# EAGLE design rover 5 (EAGLE 7.2.0)
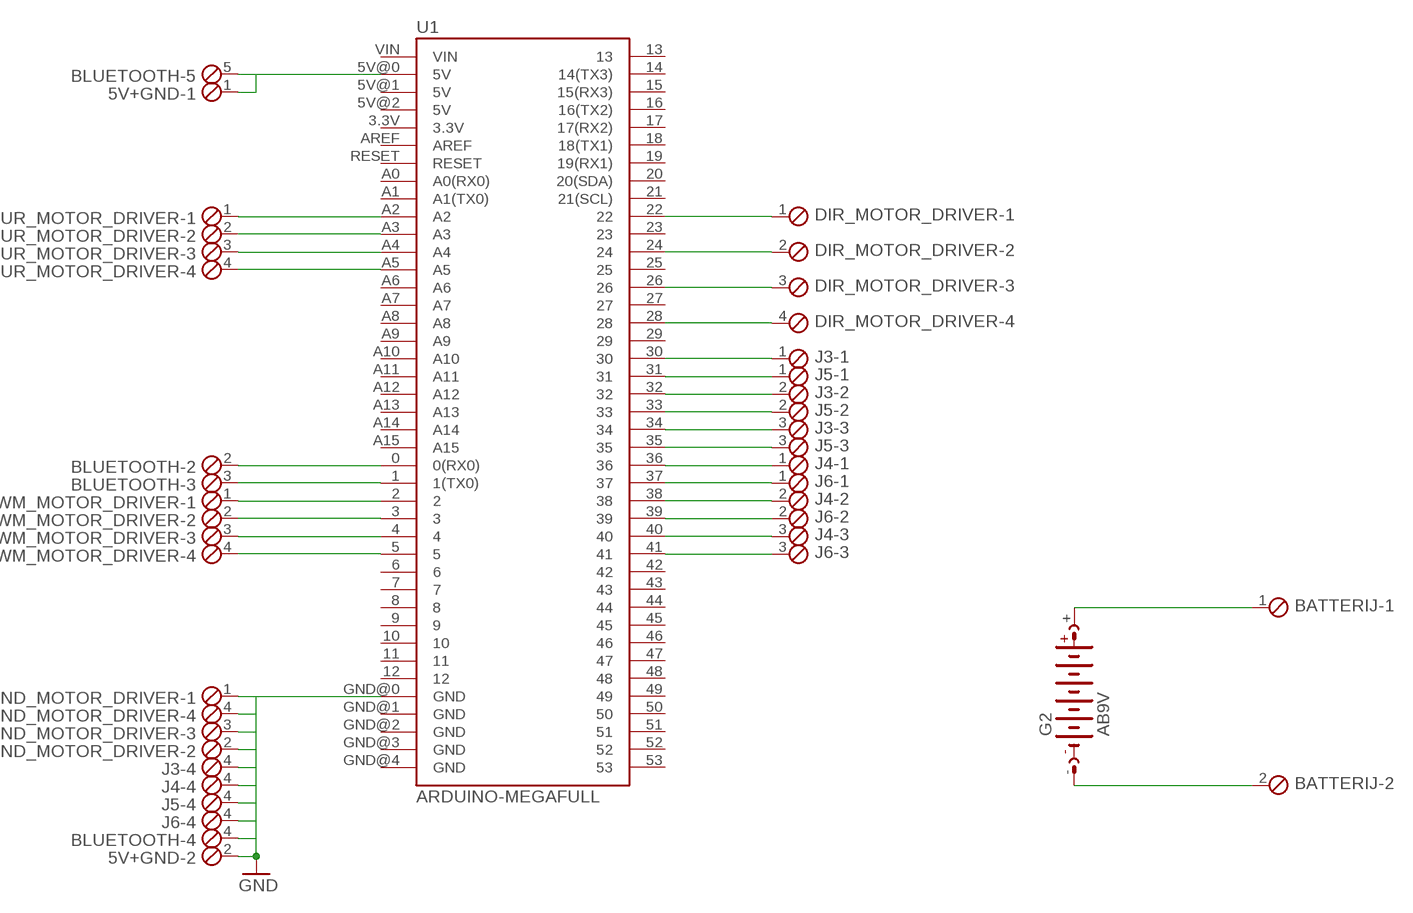
[diagram p0: schematic, sheet 1]

## Parts
5V+GND  MPT2  [2POL254]
BATTERIJ  MPT2  [2POL254]
BLUETOOTH  MPT6  [6POL254]
CUR_MOTOR_DRIVER  MPT4  [4POL254]
DIR_MOTOR_DRIVER  MPT4  [4POL254]
G2  AB9V  [AB9V]
GND_MOTOR_DRIVER  MPT4  [4POL254]
J3  MPT4  [4POL254]
J4  MPT4  [4POL254]
J5  MPT4  [4POL254]
J6  MPT4  [4POL254]
PWM_MOTOR_DRIVER  MPT4  [4POL254]
U1  ARDUINO-MEGAFULL  [ARDUINO_MEGA]

## Nets
GND: 5V+GND.2 BLUETOOTH.4 GND_MOTOR_DRIVER.1 GND_MOTOR_DRIVER.2 GND_MOTOR_DRIVER.3 GND_MOTOR_DRIVER.4 J3.4 J4.4 J5.4 J6.4 U1.GND@0(GND)
N$1: DIR_MOTOR_DRIVER.1 U1.22
N$2: PWM_MOTOR_DRIVER.1 U1.2
N$3: PWM_MOTOR_DRIVER.2 U1.3
N$4: PWM_MOTOR_DRIVER.3 U1.4
N$5: PWM_MOTOR_DRIVER.4 U1.5
N$6: DIR_MOTOR_DRIVER.2 U1.24
N$7: DIR_MOTOR_DRIVER.3 U1.26
N$8: DIR_MOTOR_DRIVER.4 U1.28
N$9: J3.1 U1.30
N$10: CUR_MOTOR_DRIVER.1 U1.A2
N$11: CUR_MOTOR_DRIVER.2 U1.A3
N$12: CUR_MOTOR_DRIVER.3 U1.A4
N$13: CUR_MOTOR_DRIVER.4 U1.A5
N$14: J5.1 U1.31
N$15: J3.2 U1.32
N$16: J5.2 U1.33
N$17: J3.3 U1.34
N$18: J5.3 U1.35
N$19: J4.1 U1.36
N$20: J6.1 U1.37
N$21: J4.2 U1.38
N$22: J6.2 U1.39
N$23: J4.3 U1.40
N$24: J6.3 U1.41
N$26: BLUETOOTH.2 U1.0(0(RX0))
N$27: BLUETOOTH.3 U1.1(1(TX0))
N$28: 5V+GND.1 BLUETOOTH.5 U1.5V@0(5V)
N$29: BATTERIJ.1 G2.+
N$30: BATTERIJ.2 G2.-
Unconnected: BLUETOOTH.1 BLUETOOTH.6 U1.3.3V U1.5V@1(5V) U1.5V@2(5V) U1.6 U1.7 U1.8 U1.9 U1.10 U1.11 U1.12 U1.13 U1.14(14(TX3)) U1.15(15(RX3)) U1.16(16(TX2)) U1.17(17(RX2)) U1.18(18(TX1)) U1.19(19(RX1)) U1.20(20(SDA)) U1.21(21(SCL)) U1.23 U1.25 U1.27 U1.29 U1.42 U1.43 U1.44 U1.45 U1.46 U1.47 U1.48 U1.49 U1.50 U1.51 U1.52 U1.53 U1.A0(A0(RX0)) U1.A1(A1(TX0)) U1.A6 U1.A7 U1.A8 U1.A9 U1.A10 U1.A11 U1.A12 U1.A13 U1.A14 U1.A15 U1.AREF U1.GND@1(GND) U1.GND@2(GND) U1.GND@3(GND) U1.GND@4(GND) U1.RESET U1.VIN

## Library data of the parts
5V+GND BATTERIJ = con-phoenix-254:MPT2: PHOENIX CONNECTOR; OC_FARNELL: unknown; OC_NEWARK: unknown
BLUETOOTH = con-phoenix-254:MPT6: PHOENIX CONNECTOR; OC_FARNELL: unknown; OC_NEWARK: unknown
CUR_MOTOR_DRIVER DIR_MOTOR_DRIVER GND_MOTOR_DRIVER J3-J6 PWM_MOTOR_DRIVER = con-phoenix-254:MPT4: PHOENIX CONNECTOR; OC_FARNELL: unknown; OC_NEWARK: unknown
G2 = rover 5 battery klem:AB9V: 9-V BATTERY CLIP
U1 = SparkFun-Boards:ARDUINO-MEGA: Arduino Mega board footprint

## Board
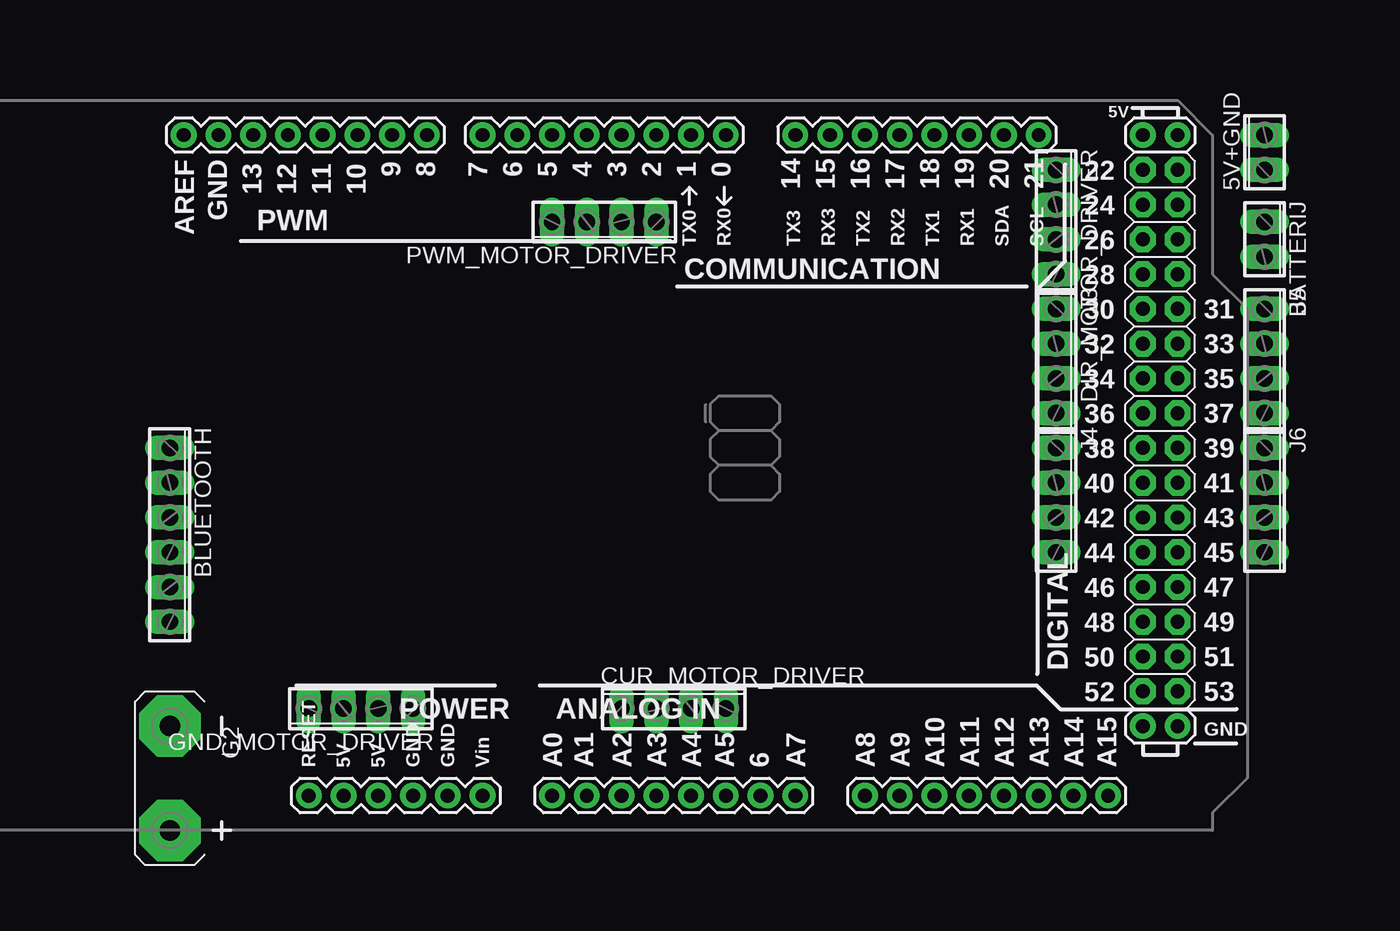
[diagram p1: board, top side]
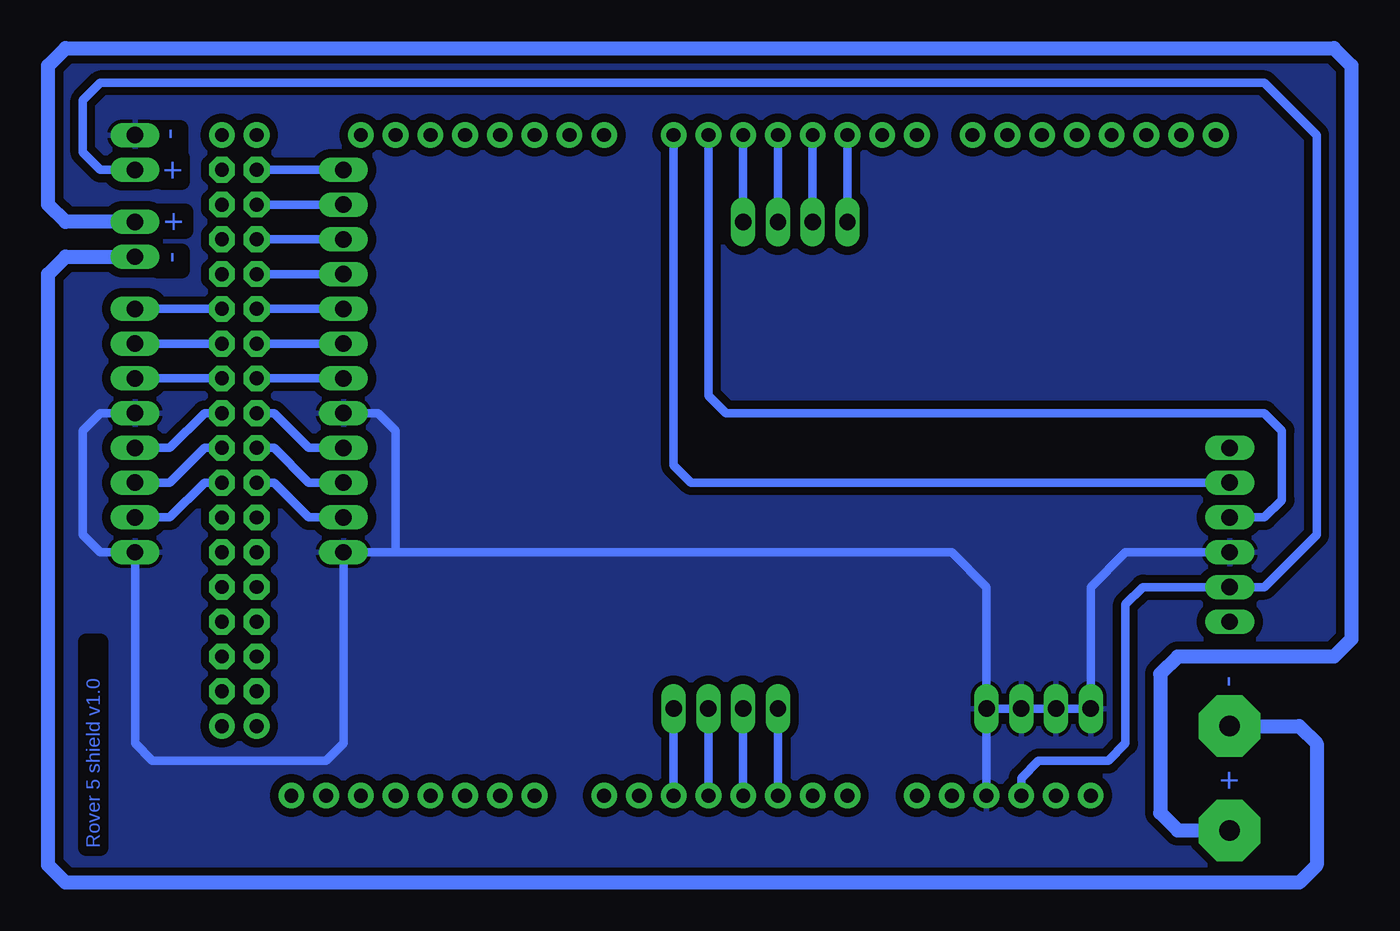
[diagram p2: board, bottom side, seen from below]

No outline drawn. Coordinates in mm, seen from the top.
Copper layers (1*16): Top 0.035mm / dielectric 1.5mm / Bottom 0.035mm
Design rules "default": minimum track width 10mil, minimum drill 24mil, track to track 8mil, track to pad 8mil, pad to pad 8mil, via to via 8mil, smd to smd 8mil, copper to edge 40mil, drill to drill 8mil, minimum pad ring 10mil, minimum via ring 8mil, stop-mask expansion 4mil, vias tented up to drill 0mil, thermal gap 10mil

### Footprints (pad centres in the part's own frame; a part is rotated, then mirrored left to right if it is on the bottom)
2POL254 = drill 1.2 long: 1 -1.27,0; 2 1.27,0
6POL254 = drill 1.2 pad 1.778 long: 1 -6.35,0; 2 -3.81,0; 3 -1.27,0; 4 1.27,0; 5 3.81,0; 6 6.35,0
4POL254 = drill 1.2 long: 1 -3.81,0; 2 -1.27,0; 3 1.27,0; 4 3.81,0
AB9V = drill 1.5 pad 4.5 octagon: + 0,2.54; - 0,-5.08
ARDUINO_MEGA = drill 1.016 pad 1.88: 0 63.5,50.8; 1 60.96,50.8; 2 58.42,50.8; 3 55.88,50.8; 3.3V 35.56,2.54; 4 53.34,50.8; 5 50.8,50.8; 5V@0 38.1,2.54; 5V@1 93.98,50.8; 5V@2 96.52,50.8; 6 48.26,50.8; 7 45.72,50.8; 8 41.656,50.8; 9 39.116,50.8; 10 36.576,50.8; 11 34.036,50.8; 12 31.496,50.8; 13 28.956,50.8; 14 68.58,50.8; 15 71.12,50.8; 16 73.66,50.8; 17 76.2,50.8; 18 78.74,50.8; 19 81.28,50.8; 20 83.82,50.8; 21 86.36,50.8; A0 50.8,2.54; A1 53.34,2.54; A2 55.88,2.54; A3 58.42,2.54; A4 60.96,2.54; A5 63.5,2.54; A6 66.04,2.54; A7 68.58,2.54; A8 73.66,2.54; A9 76.2,2.54; A10 78.74,2.54; A11 81.28,2.54; A12 83.82,2.54; A13 86.36,2.54; A14 88.9,2.54; A15 91.44,2.54; AREF 23.876,50.8; GND@0 40.64,2.54; GND@1 43.18,2.54; GND@2 93.98,7.62; GND@3 96.52,7.62; GND@4 26.416,50.8; RESET 33.02,2.54; VIN 45.72,2.54 | drill 1.016 pad 1.88 octagon: 22 93.98,48.26; 23 96.52,48.26; 24 93.98,45.72; 25 96.52,45.72; 26 93.98,43.18; 27 96.52,43.18; 28 93.98,40.64; 29 96.52,40.64; 30 93.98,38.1; 31 96.52,38.1; 32 93.98,35.56; 33 96.52,35.56; 34 93.98,33.02; 35 96.52,33.02; 36 93.98,30.48; 37 96.52,30.48; 38 93.98,27.94; 39 96.52,27.94; 40 93.98,25.4; 41 96.52,25.4; 42 93.98,22.86; 43 96.52,22.86; 44 93.98,20.32; 45 96.52,20.32; 46 93.98,17.78; 47 96.52,17.78; 48 93.98,15.24; 49 96.52,15.24; 50 93.98,12.7; 51 96.52,12.7; 52 93.98,10.16; 53 96.52,10.16

### Placement (x,y rotation side)
5V+GND  100.33,49.53 90 top
BATTERIJ  100.33,43.18 270 top
BLUETOOTH  20.32,21.59 270 top
CUR_MOTOR_DRIVER  57.15,8.89 0 top
DIR_MOTOR_DRIVER  85.09,44.45 270 top
G2  20.32,2.54 180 top
GND_MOTOR_DRIVER  34.29,8.89 180 top
J3  85.09,34.29 270 top
J4  85.09,24.13 270 top
J5  100.33,34.29 270 top
J6  100.33,24.13 270 top
PWM_MOTOR_DRIVER  52.07,44.45 180 top
U1  -2.54,0 0 top

### Tracks (layer width: path | path; a pad name or v marks a point on that pad's centre or on a via)
GND
  Bottom 0.61: U1.GND@0 GND_MOTOR_DRIVER.1 | GND_MOTOR_DRIVER.1 GND_MOTOR_DRIVER.2 GND_MOTOR_DRIVER.3 GND_MOTOR_DRIVER.4 30.48,17.78 27.94,20.32 BLUETOOTH.4 | GND_MOTOR_DRIVER.1 38.1,17.78 40.64,20.32 81.28,20.32 | 81.28,20.32 J4.4 85.09,6.35 86.36,5.08 99.06,5.08 100.33,6.35 J6.4 102.87,20.32 104.14,21.59 104.14,29.21 102.87,30.48 J5.4 | J3.4 82.55,30.48 81.28,29.21 81.28,20.32
  pour Bottom (isolate 0.61): 11.43,57.15 11.43,-3.81 106.68,-3.81 106.68,57.15
N$1
  Bottom 0.61: U1.22 DIR_MOTOR_DRIVER.1
N$2
  Bottom 0.61: U1.2 PWM_MOTOR_DRIVER.1
N$3
  Bottom 0.61: U1.3 PWM_MOTOR_DRIVER.2
N$4
  Bottom 0.61: PWM_MOTOR_DRIVER.3 U1.4
N$5
  Bottom 0.61: U1.5 PWM_MOTOR_DRIVER.4
N$6
  Bottom 0.61: DIR_MOTOR_DRIVER.2 U1.24
N$7
  Bottom 0.61: U1.26 DIR_MOTOR_DRIVER.3
N$8
  Bottom 0.61: DIR_MOTOR_DRIVER.4 U1.28
N$9
  Bottom 0.61: U1.30 J3.1
N$10
  Bottom 0.61: CUR_MOTOR_DRIVER.1 U1.A2
N$11
  Bottom 0.61: CUR_MOTOR_DRIVER.2 U1.A3
N$12
  Bottom 0.61: CUR_MOTOR_DRIVER.3 U1.A4
N$13
  Bottom 0.61: CUR_MOTOR_DRIVER.4 U1.A5
N$14
  Bottom 0.61: J5.1 U1.31
N$15
  Bottom 0.61: J3.2 U1.32
N$16
  Bottom 0.61: U1.33 J5.2
N$17
  Bottom 0.61: U1.34 J3.3
N$18
  Bottom 0.61: J5.3 U1.35
N$19
  Bottom 0.61: J4.1 87.63,27.94 90.17,30.48 U1.36
N$20
  Bottom 0.61: J6.1 97.79,27.94 95.25,30.48 U1.37
N$21
  Bottom 0.61: J4.2 87.63,25.4 90.17,27.94 U1.38
N$22
  Bottom 0.61: J6.2 97.79,25.4 95.25,27.94 U1.39
N$23
  Bottom 0.61: J4.3 87.63,22.86 90.17,25.4 U1.40
N$24
  Bottom 0.61: J6.3 97.79,22.86 95.25,25.4 U1.41
N$26
  Bottom 0.61: BLUETOOTH.2 59.69,25.4 60.96,26.67 U1.0
N$27
  Bottom 0.61: BLUETOOTH.3 17.78,22.86 16.51,24.13 16.51,29.21 17.78,30.48 57.15,30.48 58.42,31.75 U1.1
N$28
  Bottom 0.61: U1.5V@0 35.56,3.81 34.29,5.08 29.21,5.08 27.94,6.35 27.94,16.51 26.67,17.78 BLUETOOTH.5 17.78,17.78 13.97,21.59 13.97,50.8 17.78,54.61 102.87,54.61 104.14,53.34 104.14,49.53 102.87,48.26 5V+GND.1
N$29
  Bottom 1.016: BATTERIJ.1 105.41,44.45 106.68,45.72 106.68,55.88 105.41,57.15 12.7,57.15 11.43,55.88 11.43,13.97 12.7,12.7 24.13,12.7 25.4,11.43 25.4,1.27 24.13,0 G2.+
N$30
  Bottom 1.016: G2.- 15.24,7.62 13.97,6.35 13.97,-2.54 15.24,-3.81 105.41,-3.81 106.68,-2.54 106.68,40.64 105.41,41.91 BATTERIJ.2

### Text on the board
Bottom: - | + | + | - | - | + | Rover 5 shield v1.0